# EAGLE design CPU_final_rev02 (EAGLE 9.6.0)
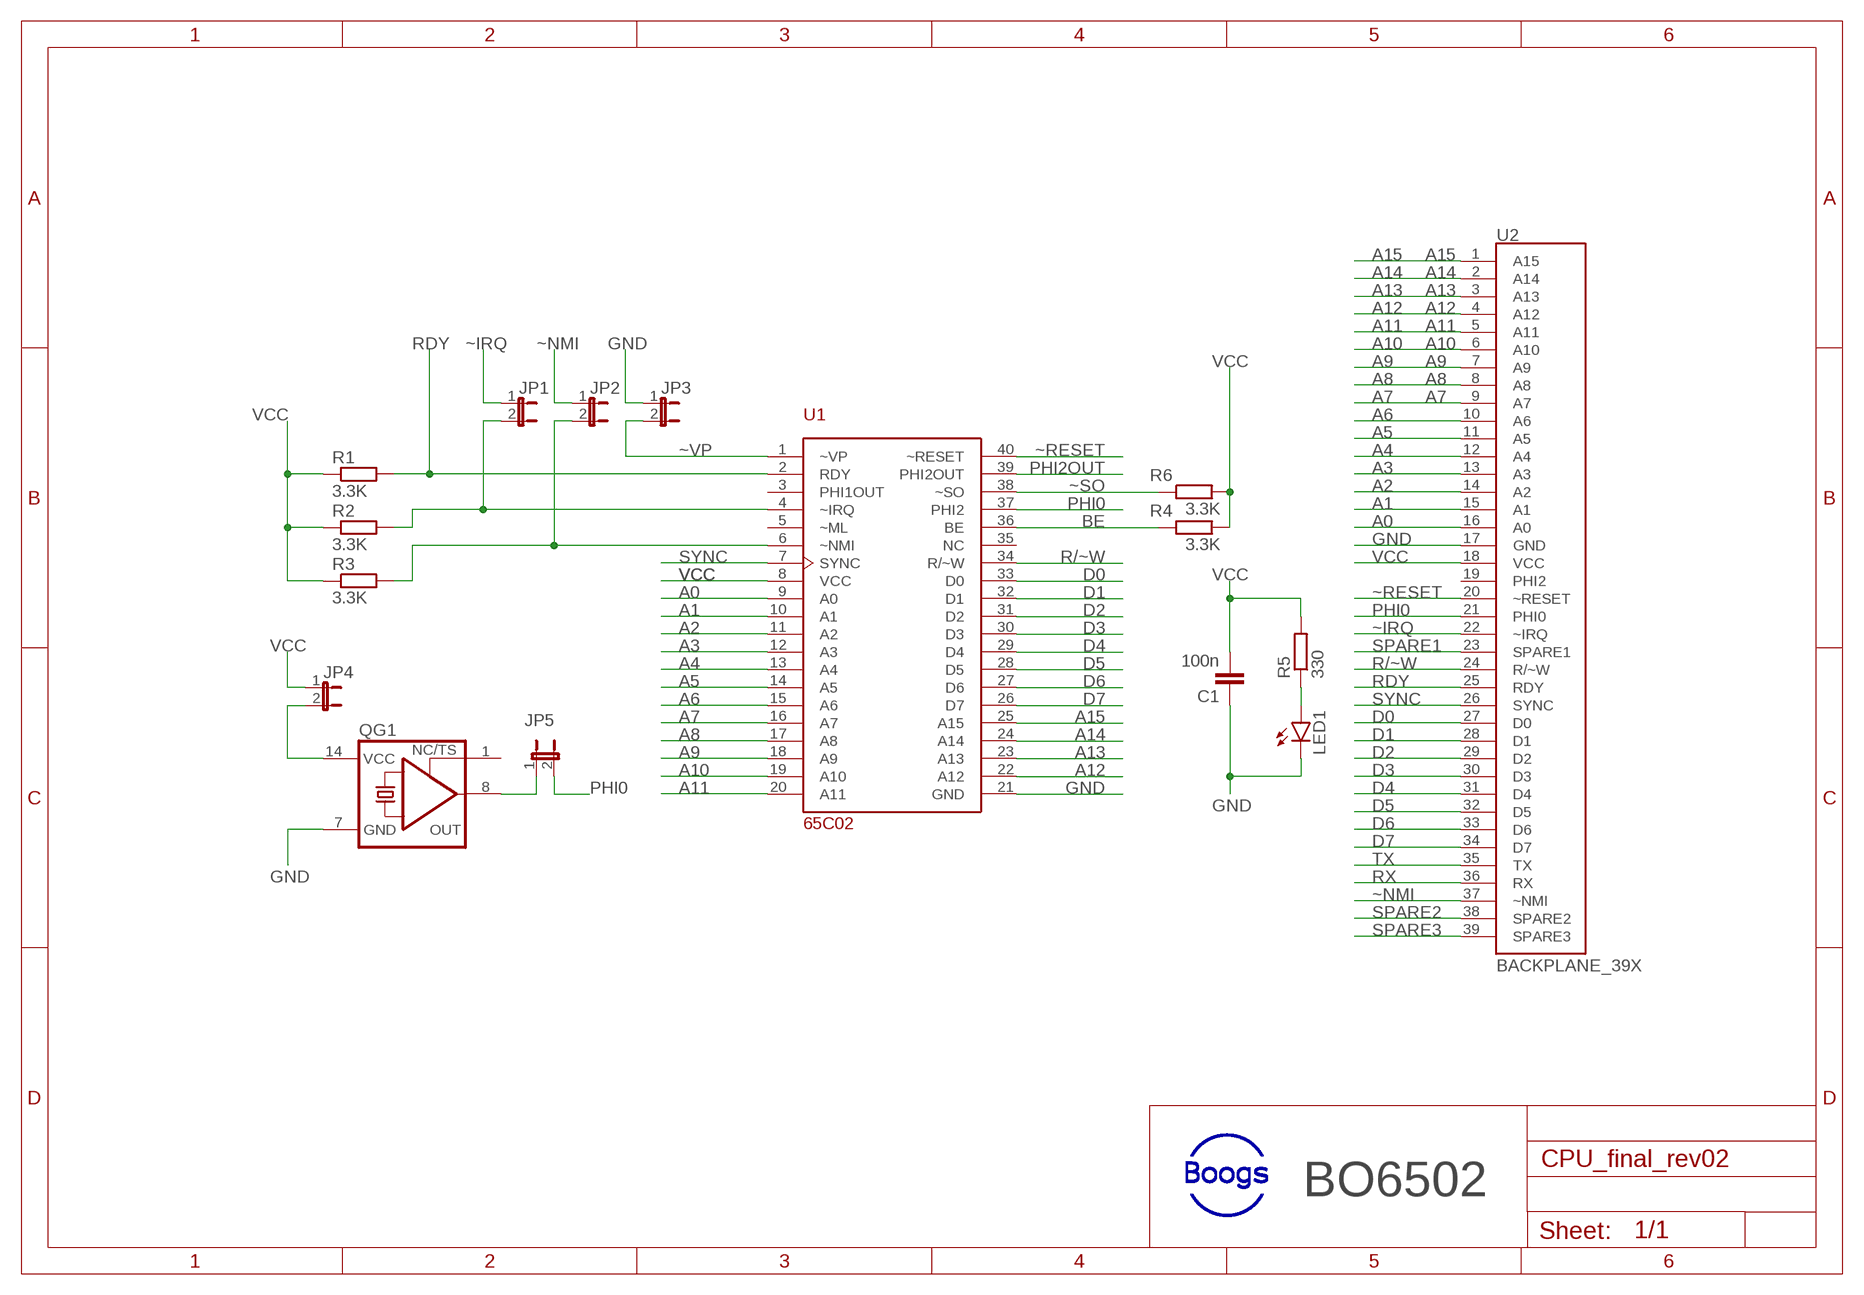
[diagram p0: schematic, sheet 1]

## Parts
C1  100n  C-EU025-025X050  [C025-025X050]
JP1  JP1E  [JP1]
JP2  JP1E  [JP1]
JP3  JP1E  [JP1]
JP4  JP1E  [JP1]
JP5  JP1E  [JP1]
LED1  LED5MM  [LED5MM]
QG1  XO-14  [DIL14S]
R1  3.3K  R-EU_0207/10  [0207/10]
R2  3.3K  R-EU_0207/10  [0207/10]
R3  3.3K  R-EU_0207/10  [0207/10]
R4  3.3K  R-EU_0207/10  [0207/10]
R5  330  R-EU_0207/10  [0207/10]
R6  3.3K  R-EU_0207/10  [0207/10]
U1  65C02  [DIL40]
U2  BACKPLANE_39X  [BP_39X]

## Nets
A0: U1.9(A0) U2.16(A0)
A1: U1.10(A1) U2.15(A1)
A2: U1.11(A2) U2.14(A2)
A3: U1.12(A3) U2.13(A3)
A4: U1.13(A4) U2.12(A4)
A5: U1.14(A5) U2.11(A5)
A6: U1.15(A6) U2.10(A6)
A7: U1.16(A7) U2.9(A7)
A8: U1.17(A8) U2.8(A8)
A9: U1.18(A9) U2.7(A9)
A10: U1.19(A10) U2.6(A10)
A11: U1.20(A11) U2.5(A11)
A12: U1.22(A12) U2.4(A12)
A13: U1.23(A13) U2.3(A13)
A14: U1.24(A14) U2.2(A14)
A15: U1.25(A15) U2.1(A15)
BE: R4.1 U1.36(BE)
D0: U1.33(D0) U2.27(D0)
D1: U1.32(D1) U2.28(D1)
D2: U1.31(D2) U2.29(D2)
D3: U1.30(D3) U2.30(D3)
D4: U1.29(D4) U2.31(D4)
D5: U1.28(D5) U2.32(D5)
D6: U1.27(D6) U2.33(D6)
D7: U1.26(D7) U2.34(D7)
GND: C1.1 JP3.1 LED1.K(C) QG1.7(GND) U1.21(GND) U2.17(GND)
N$1: JP4.2 QG1.14(VCC)
N$2: JP1.2 R2.2 U1.4(~IRQ)
N$3: JP2.2 R3.2 U1.6(~NMI)
N$4: JP5.1 QG1.8(OUT)
N$6: LED1.A R5.1
PHI0: JP5.2 U1.37(PHI2) U2.21(PHI0)
PHI2OUT: U1.39(PHI2OUT)
R/~W: U1.34(R/~W) U2.24(R/~W)
RDY: R1.2 U1.2(RDY) U2.25(RDY)
RX: U2.36(RX)
SPARE1: U2.23(SPARE1)
SPARE2: U2.38(SPARE2)
SPARE3: U2.39(SPARE3)
SYNC: U1.7(SYNC) U2.26(SYNC)
TX: U2.35(TX)
VCC: C1.2 JP4.1 R1.1 R2.1 R3.1 R4.2 R5.2 R6.2 U1.8(VCC) U2.18(VCC)
~IRQ: JP1.1 U2.22(~IRQ)
~NMI: JP2.1 U2.37(~NMI)
~RESET: U1.40(~RESET) U2.20(~RESET)
~SO: R6.1 U1.38(~SO)
~VP: JP3.2 U1.1(~VP)
Unconnected: QG1.1(TS) U1.3(PHI1OUT) U1.5(~ML) U1.35(NC) U2.19(PHI2)

## Notes on the sheet
- BO6502

## Library data of the parts
C1 = rcl:C-EU: CAPACITOR, European symbol; SPICEPREFIX: C
JP1-JP5 = jumper:JP1E: JUMPER
LED1 = led:LED: LED OSRAM: - CHIPLED LG R971, LG N971, LY N971, LG Q971, LY Q971, LO R971, LY R971 LH N974, LH R974 LS Q976, LO Q976, LY Q976 LO Q996 - Hyper CHIPLED LW Q18S LB Q993, LB Q99A, LB R99A - SideLED LS A670, LO A670, LY A670, LG A670, LP A670 LB A673, LV A673, LT A673, LW A673 LH A674 LY A675 LS A676, LA A676, LO A676, LY A676, LW A676 LS A679, LY A679, LG A679 - Hyper Micro SIDELED® LS Y876, LA Y876, LO Y876, LY Y876 LT Y87S - SmartLED LW L88C, LW L88S LB L89C, LB L89S, LG L890 LS L89K, LO L89K, LY L89K LS L896, LA L896, LO L896, LY L896 - TOPLED LS T670, LO T670, LY T670, LG T670, LP T670 LSG T670, LSP T670, LSY T670, LOP T670, LYG T670 LG T671, LOG T671, LSG T671 LB T673, LV T673, LT T673, LW T673 LH T674 LS T676, LA T676, LO T676, LY T676, LB T676, LH T676, LSB T676, LW T676 LB T67C, LV T67C, LT T67C, LS T67K, LO T67K, LY T67K, LW E67C LS E67B, LA E67B, LO E67B, LY E67B, LB E67C, LV E67C, LT E67C LW T67C LS T679, LY T679, LG T679 LS T770, LO T770, LY T770, LG T770, LP T770 LB T773, LV T773, LT T773, LW T773 LH T774 LS E675, LA E675, LY E675, LS T675 LS T776, LA T776, LO T776, LY T776, LB T776 LHGB T686 LT T68C, LB T68C - Hyper Mini TOPLED® LB M676 - Mini TOPLED Santana® LG M470 LS M47K, LO M47K, LY M47K Source: http://www.osram.convergy.de LUXEON: - LUMILED® LXK2-PW12-R00, LXK2-PW12-S00, LXK2-PW14-U00, LXK2-PW14-V00 LXK2-PM12-R00, LXK2-PM12-S00, LXK2-PM14-U00 LXK2-PE12-Q00, LXK2-PE12-R00, LXK2-PE12-S00, LXK2-PE14-T00, LXK2-PE14-U00 LXK2-PB12-K00, LXK2-PB12-L00, LXK2-PB12-M00, LXK2-PB14-N00, LXK2-PB14-P00, LXK2-PB14-Q00 LXK2-PR12-L00, LXK2-PR12-M00, LXK2-PR14-Q00, LXK2-PR14-R00 LXK2-PD12-Q00, LXK2-PD12-R00, LXK2-PD12-S00 LXK2-PH12-R00, LXK2-PH12-S00 LXK2-PL12-P00, LXK2-PL12-Q00, LXK2-PL12-R00 Source: www.luxeon.com KINGBRIGHT: KA-3528ASYC Source: www.kingbright.com
QG1 = crystal:XO-: CRYSTAL; OC_FARNELL: unknown; OC_NEWARK: unknown
R1-R6 = rcl:R-EU_: RESISTOR, European symbol; SPICEPREFIX: R
U1 = 65xx_family:65C02
U2 = 65xx_family:BACKPLANE_39X; PIN_1: A15; PIN_2: A14; PIN_3: A13; PIN_4: A12; PIN_5: A11; PIN_6: A10; PIN_7: A9; PIN_8: A8; PIN_9: A7

## Board
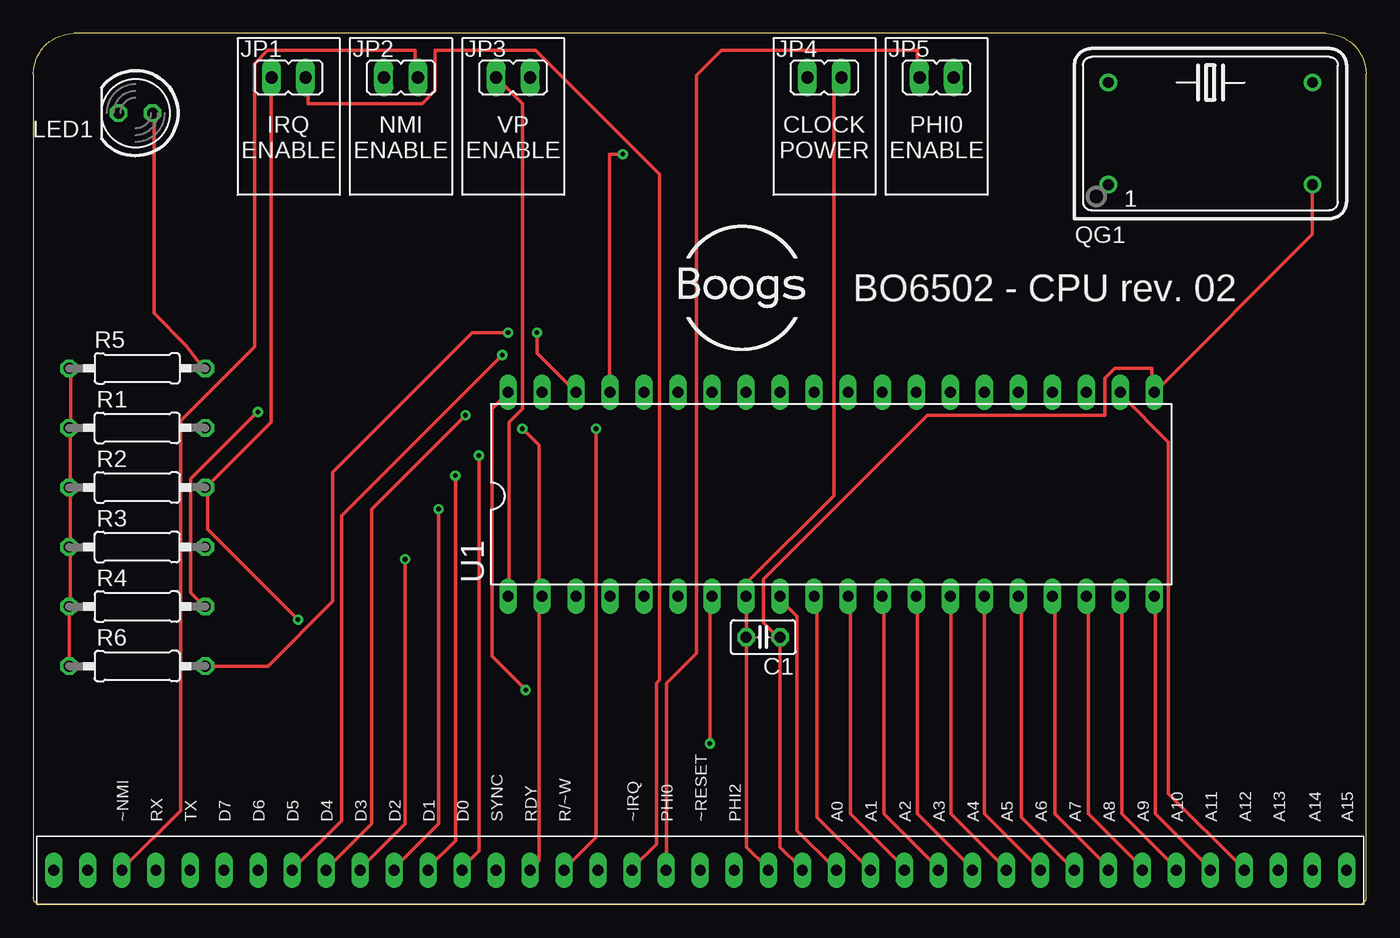
[diagram p1: board, top side]
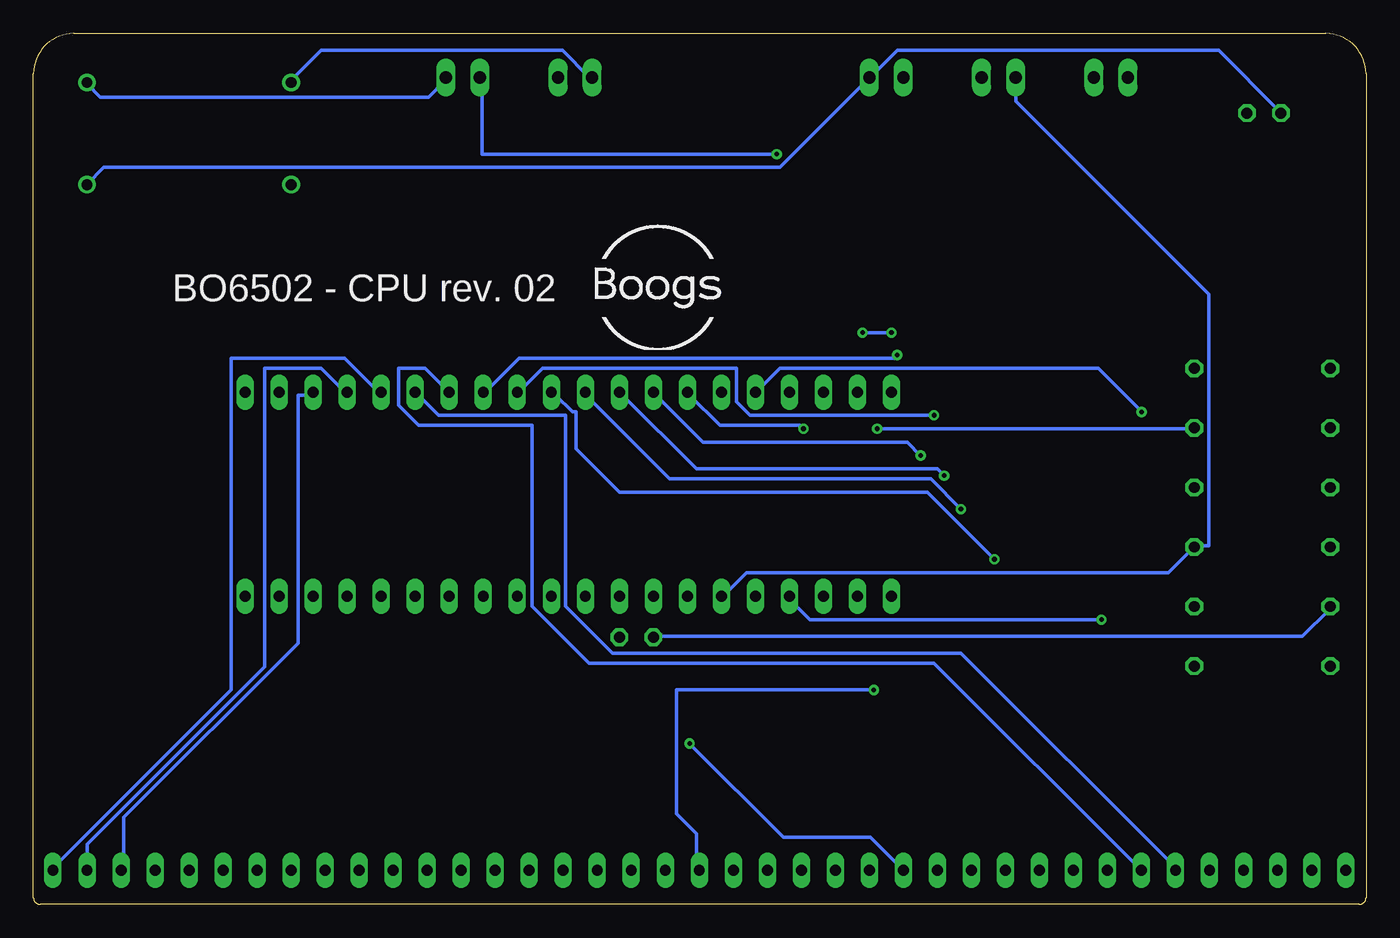
[diagram p2: board, bottom side, seen from below]

Size 99.5 x 65 mm. Coordinates in mm from the lower left corner, seen from the top.
Outline: 0.5,0 99,0 arc90 99.5,0.5 99.5,62 arc90 96.5,65 3,65 arc90 0,62 0,0.5 arc90 0.5,0
Copper layers (1*16): Top 0.035mm / dielectric 1.5mm / Bottom 0.035mm
Design rules "default *": minimum track width 10mil, minimum drill 0.35mm, track to track 10mil, track to pad 10mil, pad to pad 10mil, via to via 10mil, smd to smd 6mil, copper to edge 40mil, drill to drill 6mil, minimum pad ring 10mil, minimum via ring 8mil, stop-mask expansion 4mil, vias tented up to drill 15mil, thermal gap 10mil

### Footprints (pad centres in the part's own frame; a part is rotated, then mirrored left to right if it is on the bottom)
C025-025X050 = drill 0.813 octagon: 1 -1.27,0; 2 1.27,0
JP1 = drill 0.914 long: 1 0,-1.27; 2 0,1.27
LED5MM = drill 0.813 octagon: A -1.27,0; K 1.27,0
DIL14S = drill 0.813: 1 -7.62,-3.81; 7 7.62,-3.81; 8 7.62,3.81; 14 -7.62,3.81
0207/10 = drill 0.813 octagon: 1 -5.08,0; 2 5.08,0
DIL40 = drill 0.813 long: 1 -24.13,-7.62; 2 -21.59,-7.62; 3 -19.05,-7.62; 4 -16.51,-7.62; 5 -13.97,-7.62; 6 -11.43,-7.62; 7 -8.89,-7.62; 8 -6.35,-7.62; 9 -3.81,-7.62; 10 -1.27,-7.62; 11 1.27,-7.62; 12 3.81,-7.62; 13 6.35,-7.62; 14 8.89,-7.62; 15 11.43,-7.62; 16 13.97,-7.62; 17 16.51,-7.62; 18 19.05,-7.62; 19 21.59,-7.62; 20 24.13,-7.62; 21 24.13,7.62; 22 21.59,7.62; 23 19.05,7.62; 24 16.51,7.62; 25 13.97,7.62; 26 11.43,7.62; 27 8.89,7.62; 28 6.35,7.62; 29 3.81,7.62; 30 1.27,7.62; 31 -1.27,7.62; 32 -3.81,7.62; 33 -6.35,7.62; 34 -8.89,7.62; 35 -11.43,7.62; 36 -13.97,7.62; 37 -16.51,7.62; 38 -19.05,7.62; 39 -21.59,7.62; 40 -24.13,7.62
BP_39X = drill 0.813 long: 1 1.27,59.69; 2 1.27,57.15; 3 1.27,54.61; 4 1.27,52.07; 5 1.27,49.53; 6 1.27,46.99; 7 1.27,44.45; 8 1.27,41.91; 9 1.27,39.37; 10 1.27,36.83; 11 1.27,34.29; 12 1.27,31.75; 13 1.27,29.21; 14 1.27,26.67; 15 1.27,24.13; 16 1.27,21.59; 17 1.27,19.05; 18 1.27,16.51; 19 1.27,13.97; 20 1.27,11.43; 21 1.27,8.89; 22 1.27,6.35; 23 1.27,3.81; 24 1.27,1.27; 25 1.27,-1.27; 26 1.27,-3.81; 27 1.27,-6.35; 28 1.27,-8.89; 29 1.27,-11.43; 30 1.27,-13.97; 31 1.27,-16.51; 32 1.27,-19.05; 33 1.27,-21.59; 34 1.27,-24.13; 35 1.27,-26.67; 36 1.27,-29.21; 37 1.27,-31.75; 38 1.27,-34.29; 39 1.27,-36.83

### Placement (x,y rotation side)
C1  54.48,19.94 180 top
JP1  19.05,61.72 90 top
JP2  27.43,61.72 90 top
JP3  35.81,61.72 90 top
JP4  59.05,61.72 90 top
JP5  67.44,61.72 90 top
LED1  7.62,59.05 180 top
QG1  87.88,57.53 0 top
R1  7.75,35.56 0 top
R2  7.75,31.11 0 top
R3  7.75,26.67 0 top
R4  7.75,22.23 180 top
R5  7.75,40.01 180 top
R6  7.75,17.78 180 top
U1  59.56,30.61 0 top
U2  38.35,3.81 270 top

### Tracks (layer width: path | path; a pad name or v marks a point on that pad's centre or on a via)
A0
  Top 0.254: U2.16 59.75,2.75 57,5.5 57,21.5 55.75,22.75 U1.9
A1
  Top 0.254: U2.15 62.25,2.75 58.5,6.5 58.5,22.75 U1.10
A2
  Top 0.254: U2.14 65,2.75 61,6.75 61,22.75 U1.11
A3
  Top 0.254: U2.13 67.5,2.75 63.5,6.75 63.5,22.75 U1.12
A4
  Top 0.254: U2.12 70,2.75 66,6.75 66,22.75 U1.13
A5
  Top 0.254: U2.11 72.5,2.75 68.5,6.75 68.5,22.75 U1.14
A6
  Top 0.254: U2.10 75,2.75 71,6.75 71,22.75 U1.15
A7
  Top 0.254: U2.9 77.5,2.75 73.75,6.5 73.75,22.75 U1.16
A8
  Top 0.254: U2.8 80.25,2.75 76.25,6.75 76.25,22.75 U1.17
A9
  Top 0.254: U2.7 82.75,2.75 78.75,6.75 78.75,22.75 U1.18
A10
  Top 0.254: U2.6 85.25,2.75 81.25,6.75 81.25,22.75 U1.19
A11
  Top 0.254: U2.5 87.75,2.75 83.75,6.75 83.75,22.75 U1.20
A12
  Top 0.254: U2.4 90.25,2.75 84.75,8.25 84.75,34.5 81.25,38 U1.22
A13
  Bottom 0.254: U2.3 92.75,2.75 92.75,6.5 79.75,19.5 79.75,38 78.75,38 U1.23
A14
  Bottom 0.254: U2.2 95.5,4.5 82.25,17.75 82.25,40 78,40 76.25,38.25 U1.24
A15
  Bottom 0.254: U2.1 98,2.75 84.75,16 84.75,40.75 76.25,40.75 73.75,38.25 U1.25
BE  (via drill 0.35)
  Top 0.254: v16.75,36.75 11.75,31.75 11.75,23.25 12.75,22.25 R4.1
  Bottom 0.254: v16.75,36.75 20,40 43.75,40 45.5,38.25 U1.36
D0  (via drill 0.35)
  Top 0.254: v33.25,33.5 33.25,4 32,2.75 U2.27
  Bottom 0.254: v33.25,33.5 34.25,34.5 49.5,34.5 53,38 U1.33
D1  (via drill 0.35)
  Top 0.254: v31.5,32 31.5,4.75 29.5,2.75 U2.28
  Bottom 0.254: v31.5,32 32,32.5 50,32.5 55.5,38 U1.32
D2  (via drill 0.35)
  Top 0.254: v30.25,29.5 30.25,6 27,2.75 U2.29
  Bottom 0.254: v30.25,29.5 32.5,31.75 52,31.75 58.25,38 U1.31
D3  (via drill 0.35)
  Top 0.254: v27.75,25.75 27.75,6 24.5,2.75 U2.30
  Bottom 0.254: v27.75,25.75 32.75,30.75 55.75,30.75 59,34 59,36.75 59.25,36.75 60.5,38 60.75,38 U1.30
D4  (via drill 0.35)
  Top 0.254: v32.25,36.5 25.25,29.5 25.25,6 22,2.75 U2.31
  Bottom 0.254: v32.25,36.5 46,36.5 47,37.5 47,40 61.5,40 63.25,38.25 U1.29
D5  (via drill 0.35)
  Top 0.254: v35,41 23,29 23,6.25 19.5,2.75 U2.32
  Bottom 0.254: v35,41 35.25,40.75 63.25,40.75 65.75,38.25 U1.28
D6
  Bottom 0.254: U2.33 17,2.75 32.25,18 58,18 62.25,22.25 62.25,35.75 70.75,35.75 72.25,37.25 72.25,40 70.25,40 68.5,38.25 U1.27
D7
  Bottom 0.254: U2.34 14.25,2.75 30.25,18.75 56.25,18.75 59.75,22.25 59.75,36.5 69.25,36.5 70.75,38 U1.26
GND
  Top 0.254: U2.17 57.25,2.75 55.75,4.25 55.75,19.75 C1.1 55.5,20 54.5,21 54.5,24.25 66.75,36.5 80,36.5 80,39.25 80.75,40 83.5,40 83.5,38.25 U1.21 83.75,38.25 95.5,50 QG1.7
  Bottom 0.254: LED1.K 6.5,59.25 11,63.75 35,63.75 37,61.75 JP3.1 37.25,61.5 43.75,55 94.25,55 95.5,53.75 QG1.7
N$1
  Bottom 0.254: QG1.14 80.25,61.5 78,63.75 60,63.75 58,61.75 JP4.2
N$2  (via drill 0.35)
  Top 0.254: JP1.2 17.75,61.5 17.75,36 13,31.25 R2.2 13,31 13,28 v19.75,21.25
  Bottom 0.254: v19.75,21.25 41.5,21.25 43,22.75 U1.4
N$3
  Bottom 0.254: U1.6 48,23 46.25,24.75 14.75,24.75 13,26.5 R3.2 12.75,26.75 11.75,26.75 11.75,45.54 26.16,59.94 JP2.2
N$4
  Bottom 0.254: QG1.8 95.5,61.25 94.5,60.25 70,60.25 68.75,61.5 JP5.1
N$6
  Top 0.254: R5.1 12.27,40.57 11.37,41.74 9,44.11 9,59 LED1.A
PHI0  (via drill 0.35)
  Top 0.254: U2.21 47.25,2.75 47.25,16.5 49.5,18.75 49.5,61.89 51.37,63.75 66,63.75 66,61.75 JP5.2 | v44,56 43,56 43,38.5 U1.37
  Bottom 0.254: v44,56 66,56 66,61.5 JP5.2
R/~W  (via drill 0.35)
  Top 0.254: v42,35.5 42,5 39.75,2.75 U2.24
  Bottom 0.254: v42,35.5 42.25,35.75 48.25,35.75 50.5,38 U1.34
RDY  (via drill 0.35)
  Top 0.254: U2.25 37.25,2.75 37.75,3.25 37.75,22.75 U1.2 37.75,23 37.75,34.25 v36.5,35.5
  Bottom 0.254: v36.5,35.5 13,35.5 R1.2
SYNC  (via drill 0.35)
  Top 0.254: v50.5,12 50.5,22.75 U1.7
  Bottom 0.254: U2.26 37,5 43.5,5 v50.5,12
VCC
  Top 0.254: U2.18 54.75,2.75 53.25,4.25 53.25,19.75 C1.2 53.25,20 53.25,22.75 U1.8 53.25,23 53.25,24 59.75,30.5 59.75,61 60.25,61.5 JP4.1 | R6.2 R4.2 2.75,22.25 2.75,26.5 R3.1 2.75,26.75 2.75,31 R2.1 2.75,31.25 2.75,35.5 R1.1 2.79,35.84 2.79,39.24 2.79,39.88 R5.2
  Bottom 0.254: R4.2 2.75,22 4.75,20 53,20 C1.2
~IRQ
  Top 0.254: U2.22 44.75,2.75 46.5,4.5 46.5,16.5 46.75,16.75 46.75,54.5 37.5,63.75 30,63.75 30,60.75 29,59.75 20.5,59.75 20.5,61.5 JP1.1
~NMI
  Top 0.254: U2.37 6.75,2.75 11,7 11,36.1 16.5,41.6 16.5,62.75 17.5,63.75 28.5,63.75 28.5,61.75 JP2.1
~RESET  (via drill 0.35)
  Top 0.254: v36.75,16 34.25,18.5 34.25,37 35.25,38 U1.40
  Bottom 0.254: v36.75,16 51.5,16 51.5,6.75 50,5.25 50,2.75 U2.20
~SO  (via drill 0.35)
  Top 0.254: R6.1 17.53,17.78 22.35,22.61 22.35,32.26 32.77,42.67 v35.43,42.67 | v37.59,42.67 37.59,41.15 U1.38
  Bottom 0.254: v37.59,42.67 v35.43,42.67
~VP
  Top 0.254: U1.1 35.5,23 35.5,36 36.5,37 36.5,59.75 34.75,61.5 JP3.2

### Text on the board
tNames: IRQ / ENABLE | NMI / ENABLE | VP / ENABLE | CLOCK / POWER | PHI0 / ENABLE | BO6502 - CPU rev. 02 | ~NMI | RX | TX | D7 | D6 | D5 | D4 | D3 | D2 | D1 | D0 | SYNC | RDY | R/~W | ~IRQ | PHI0 | ~RESET | PHI2 | A0 | A1 | A2 | A3 | A4 | A5 | A6 | A7 | A8 | A9 | A10 | A11 | A12 | A13 | A14 | A15
bNames: BO6502 - CPU rev. 02